# EAGLE schematic seven_seg (EAGLE 9.6.2)
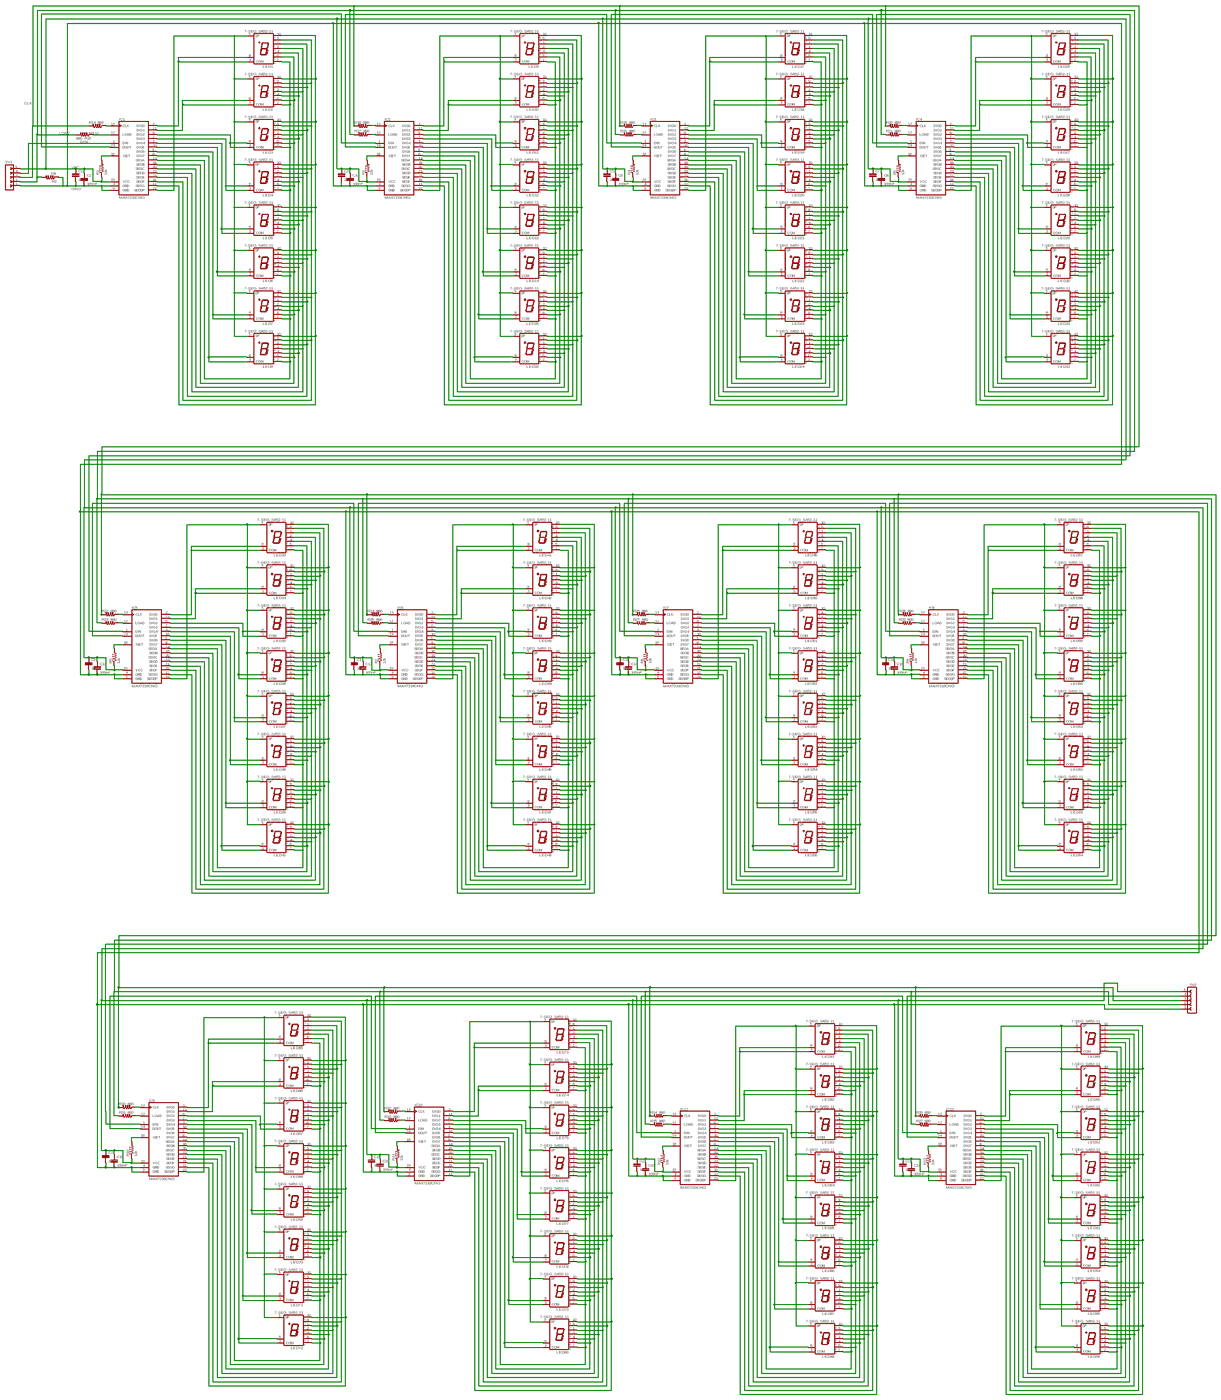
[diagram p0: schematic, sheet 1, overview]
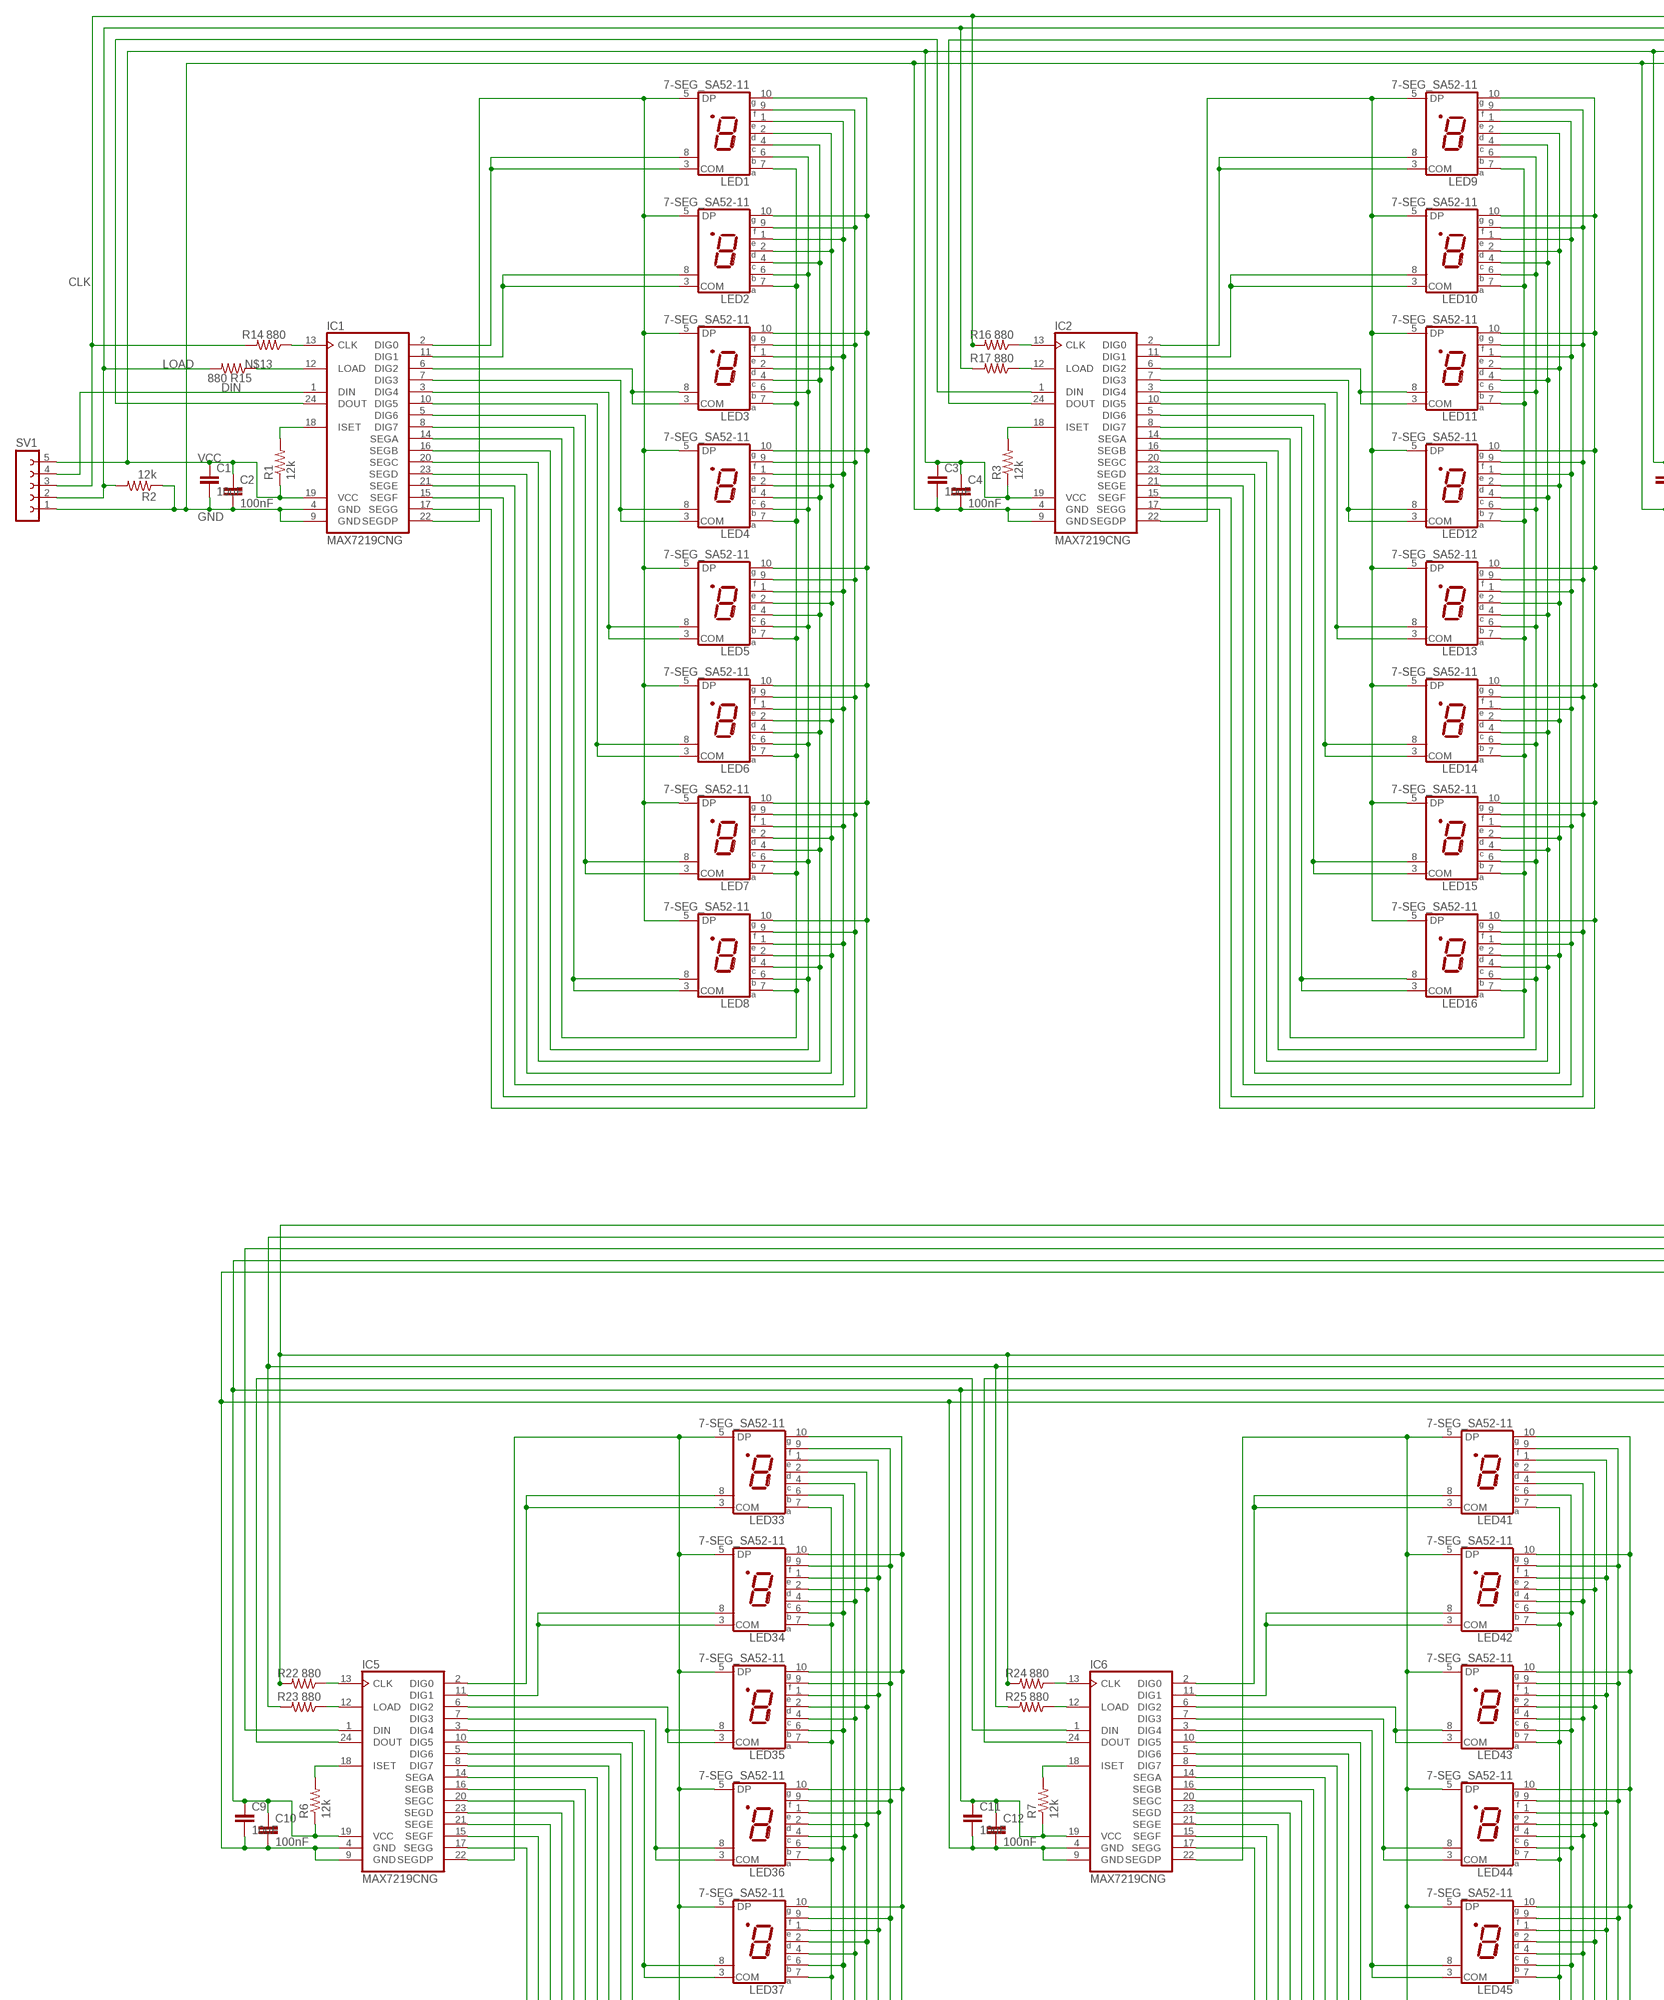
[diagram p1: schematic, sheet 1, part 1 of 4]
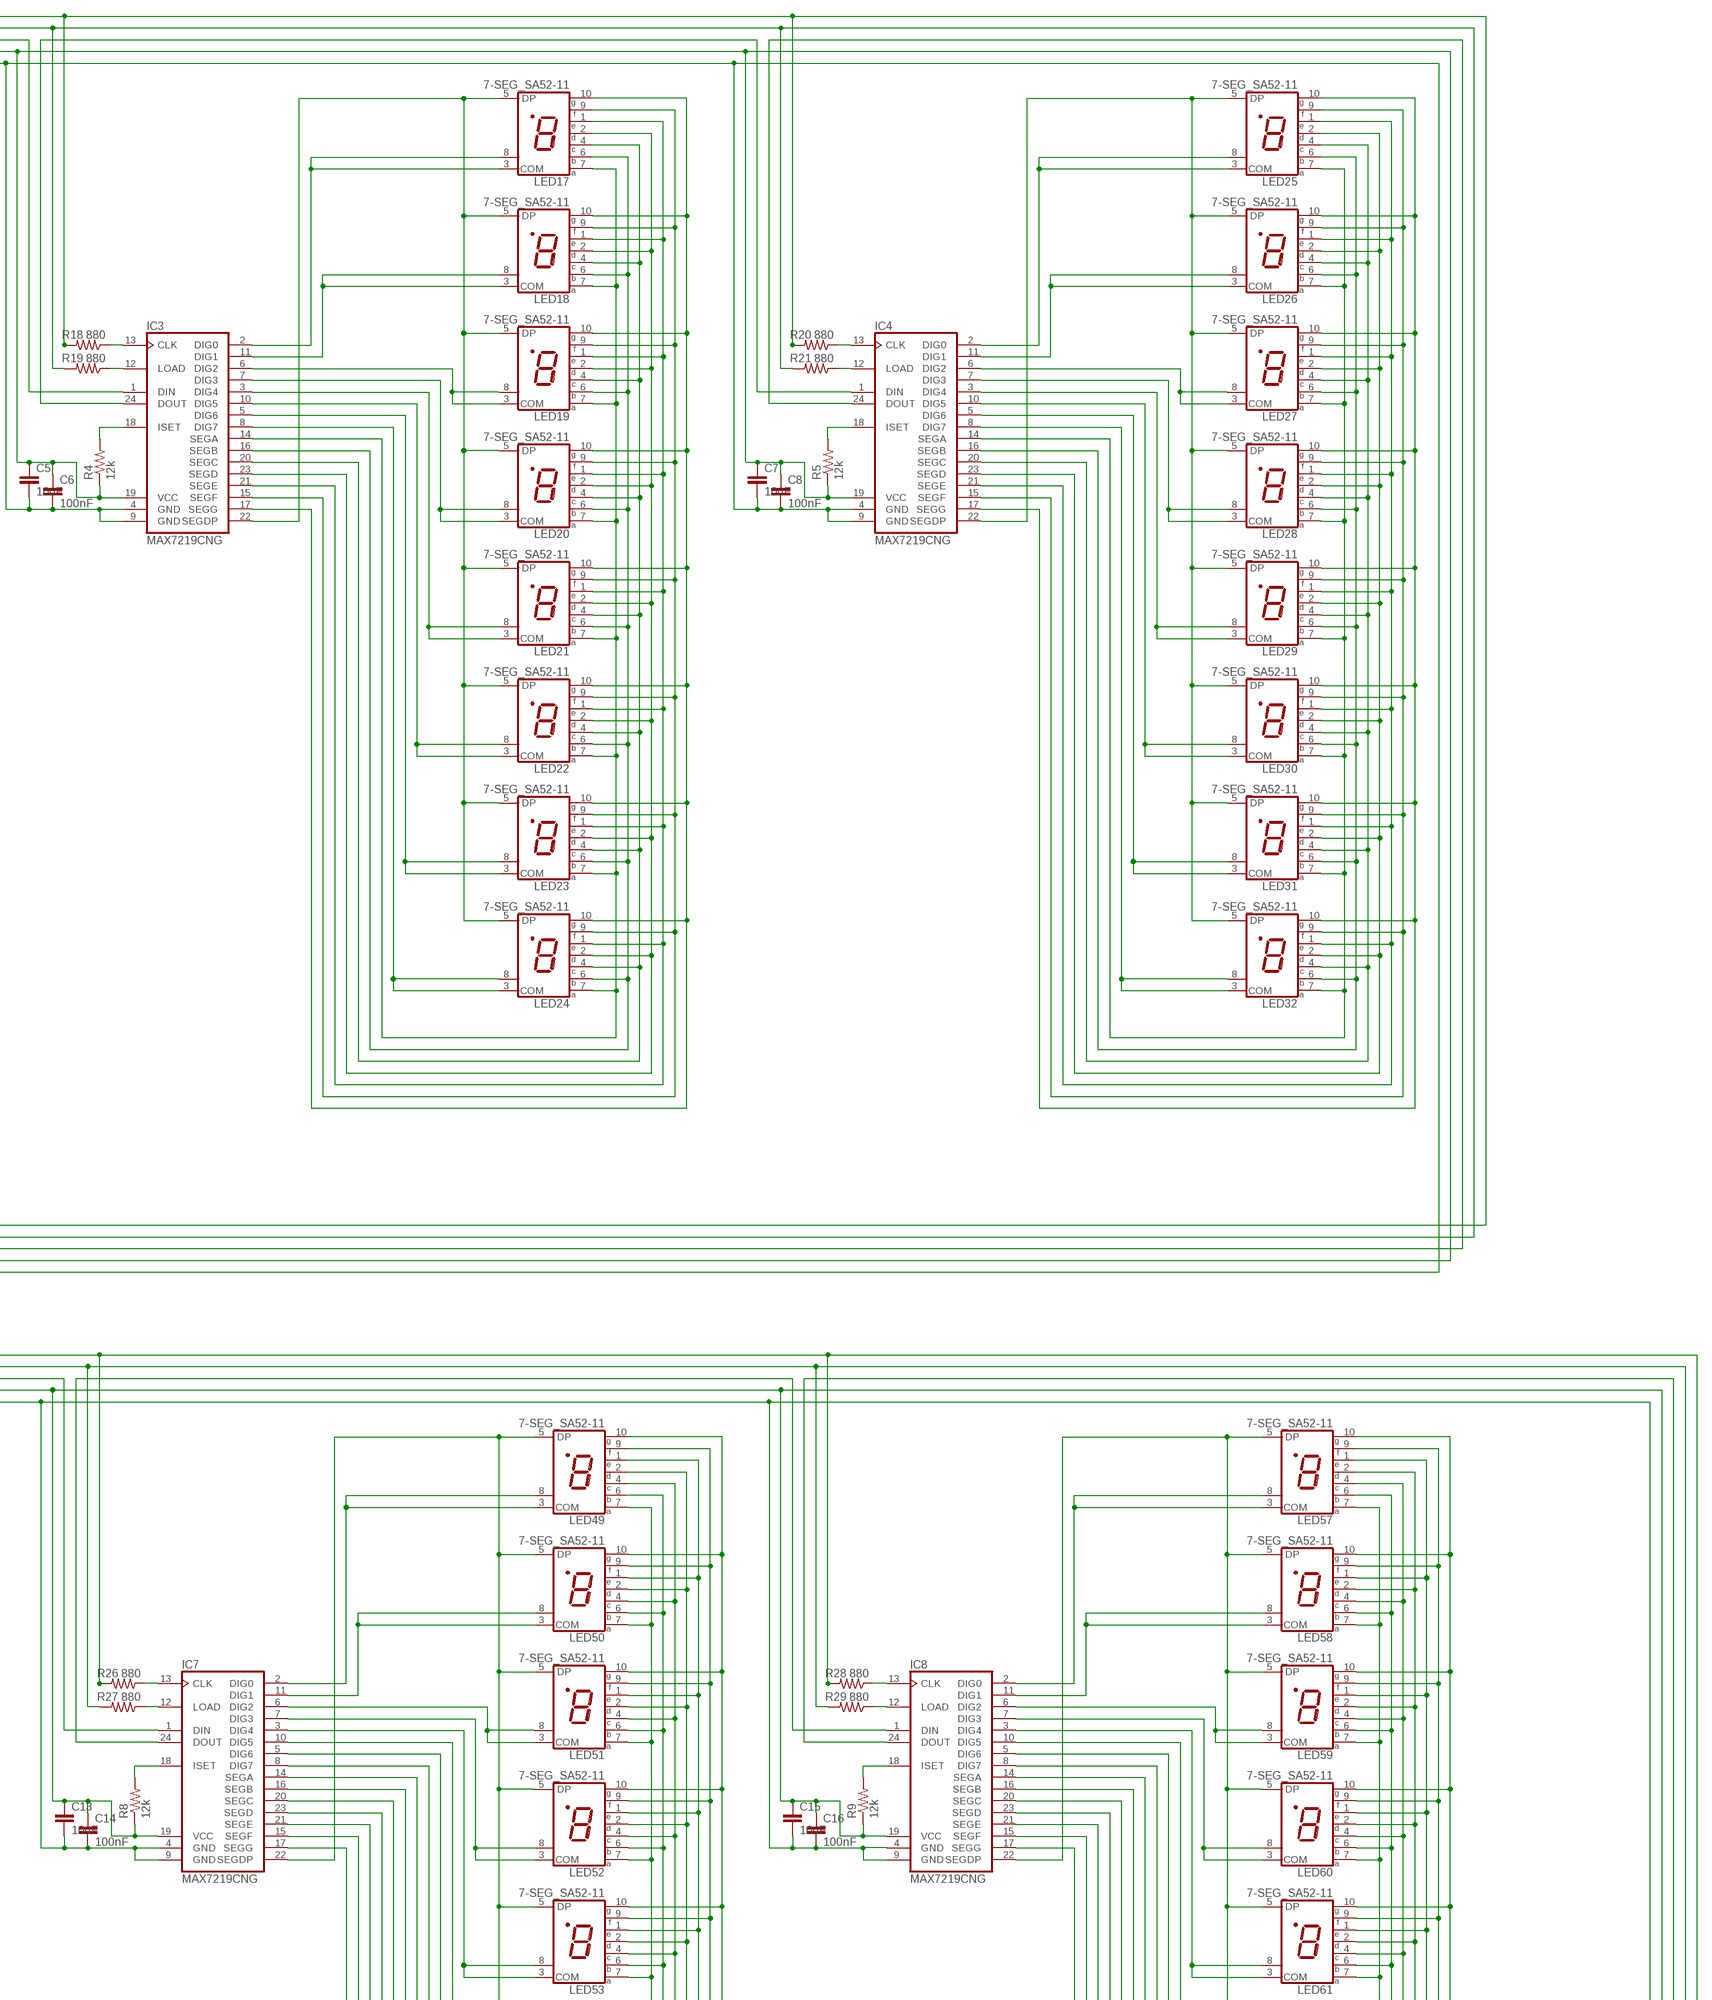
[diagram p2: schematic, sheet 1, part 2 of 4]
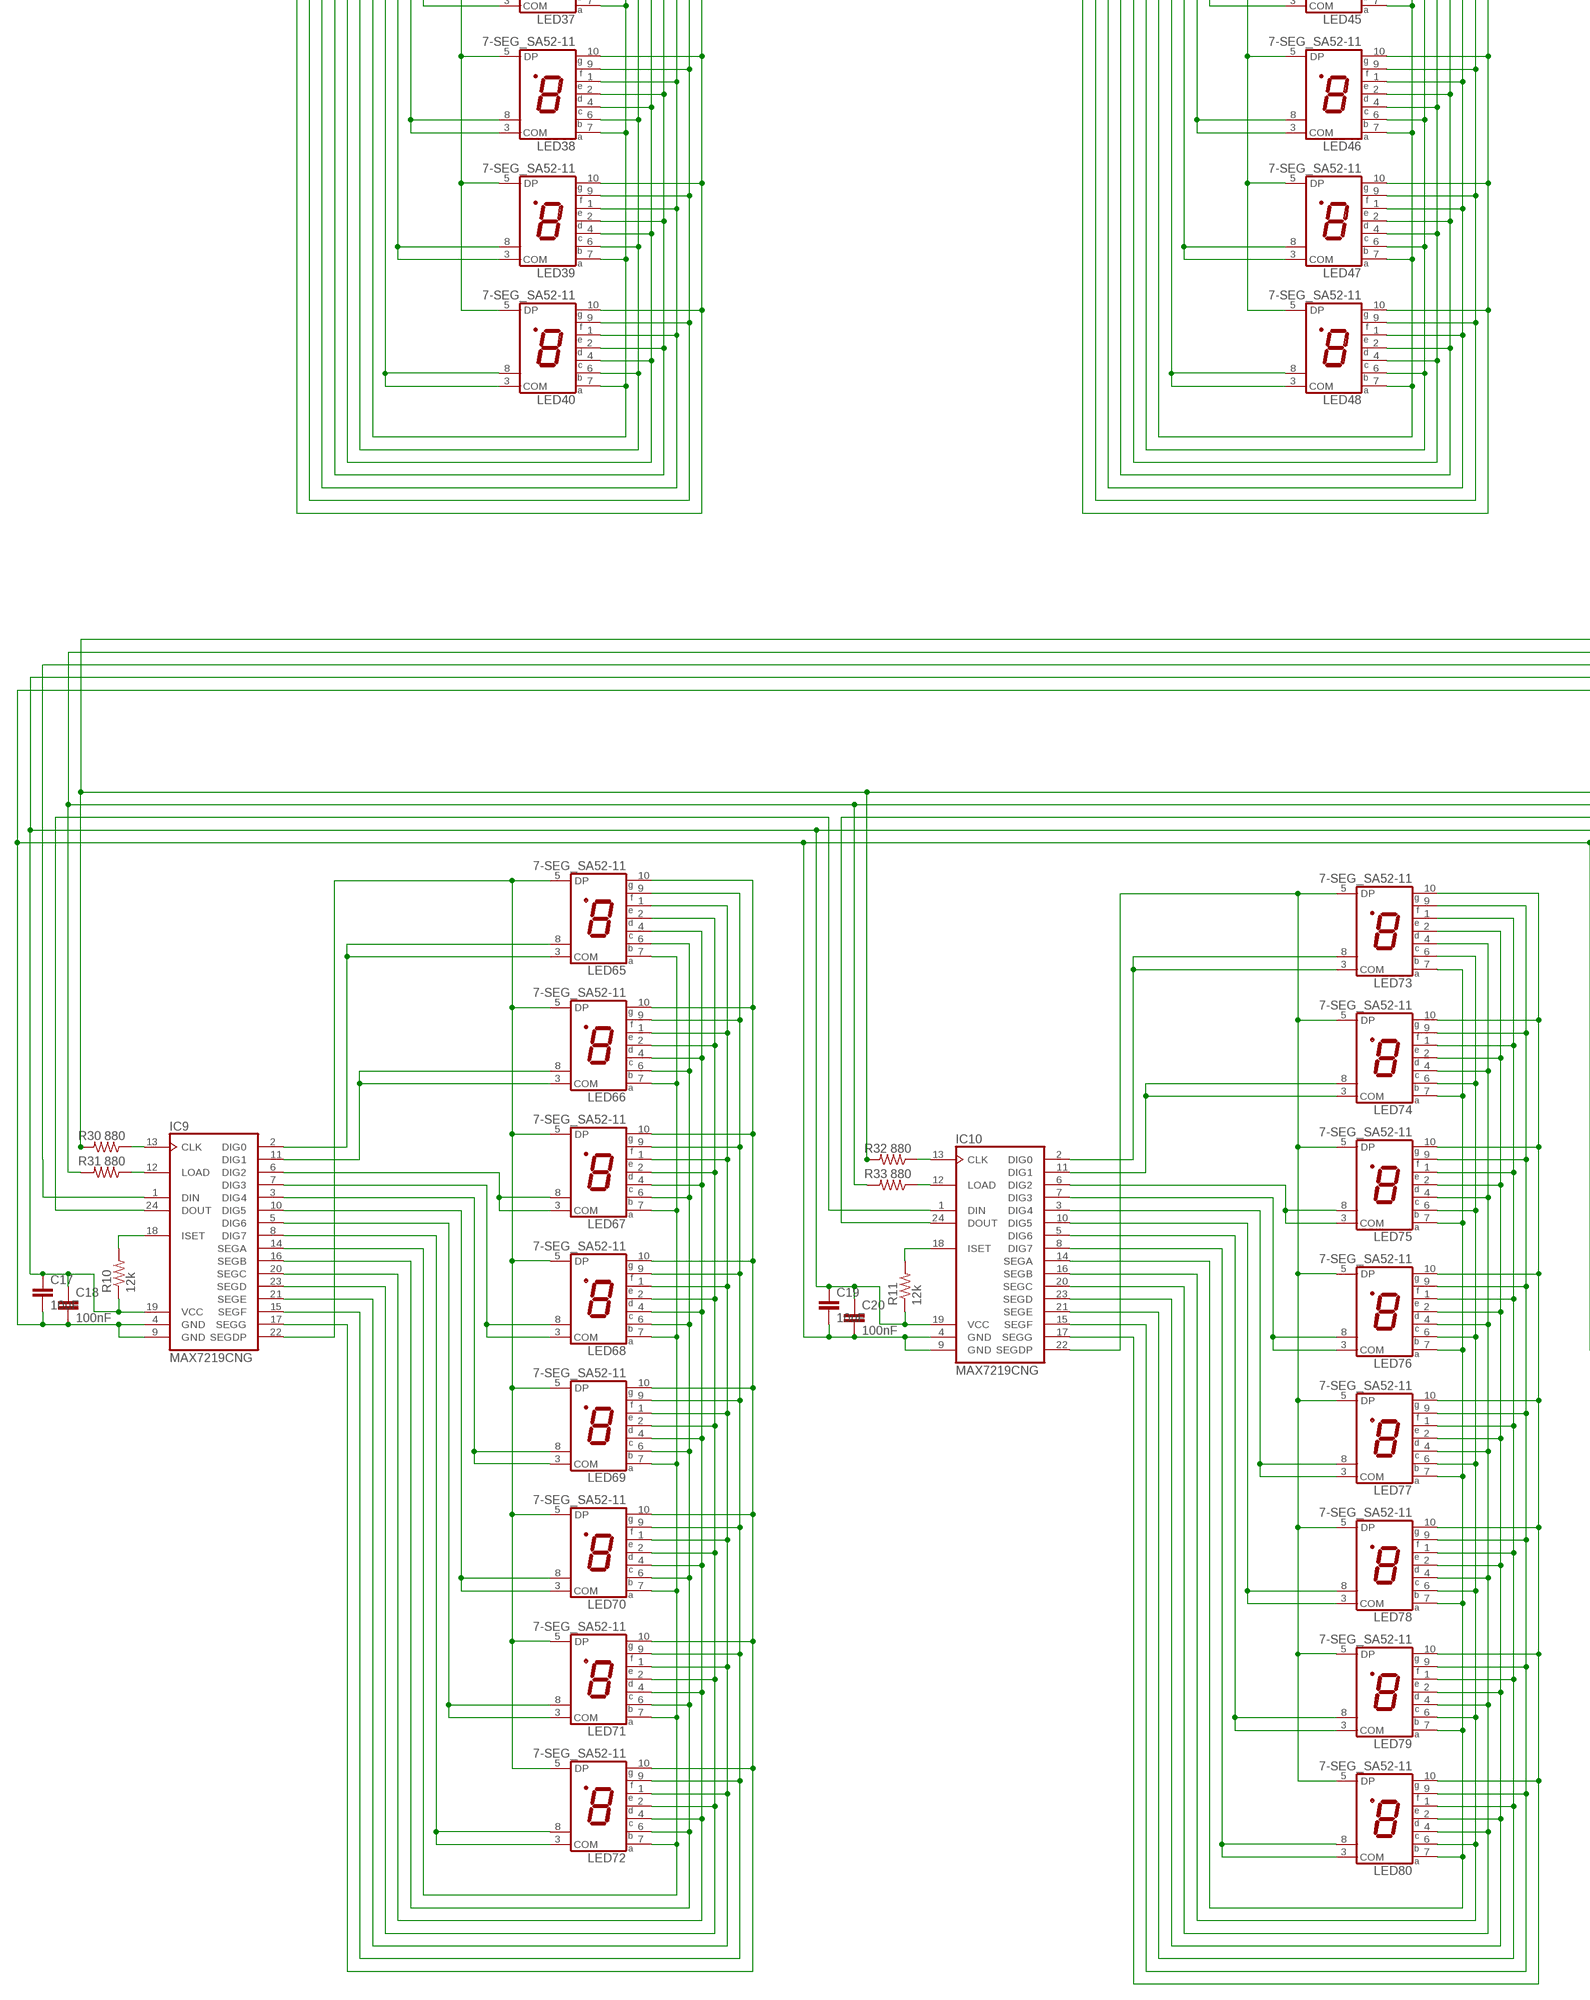
[diagram p3: schematic, sheet 1, part 3 of 4]
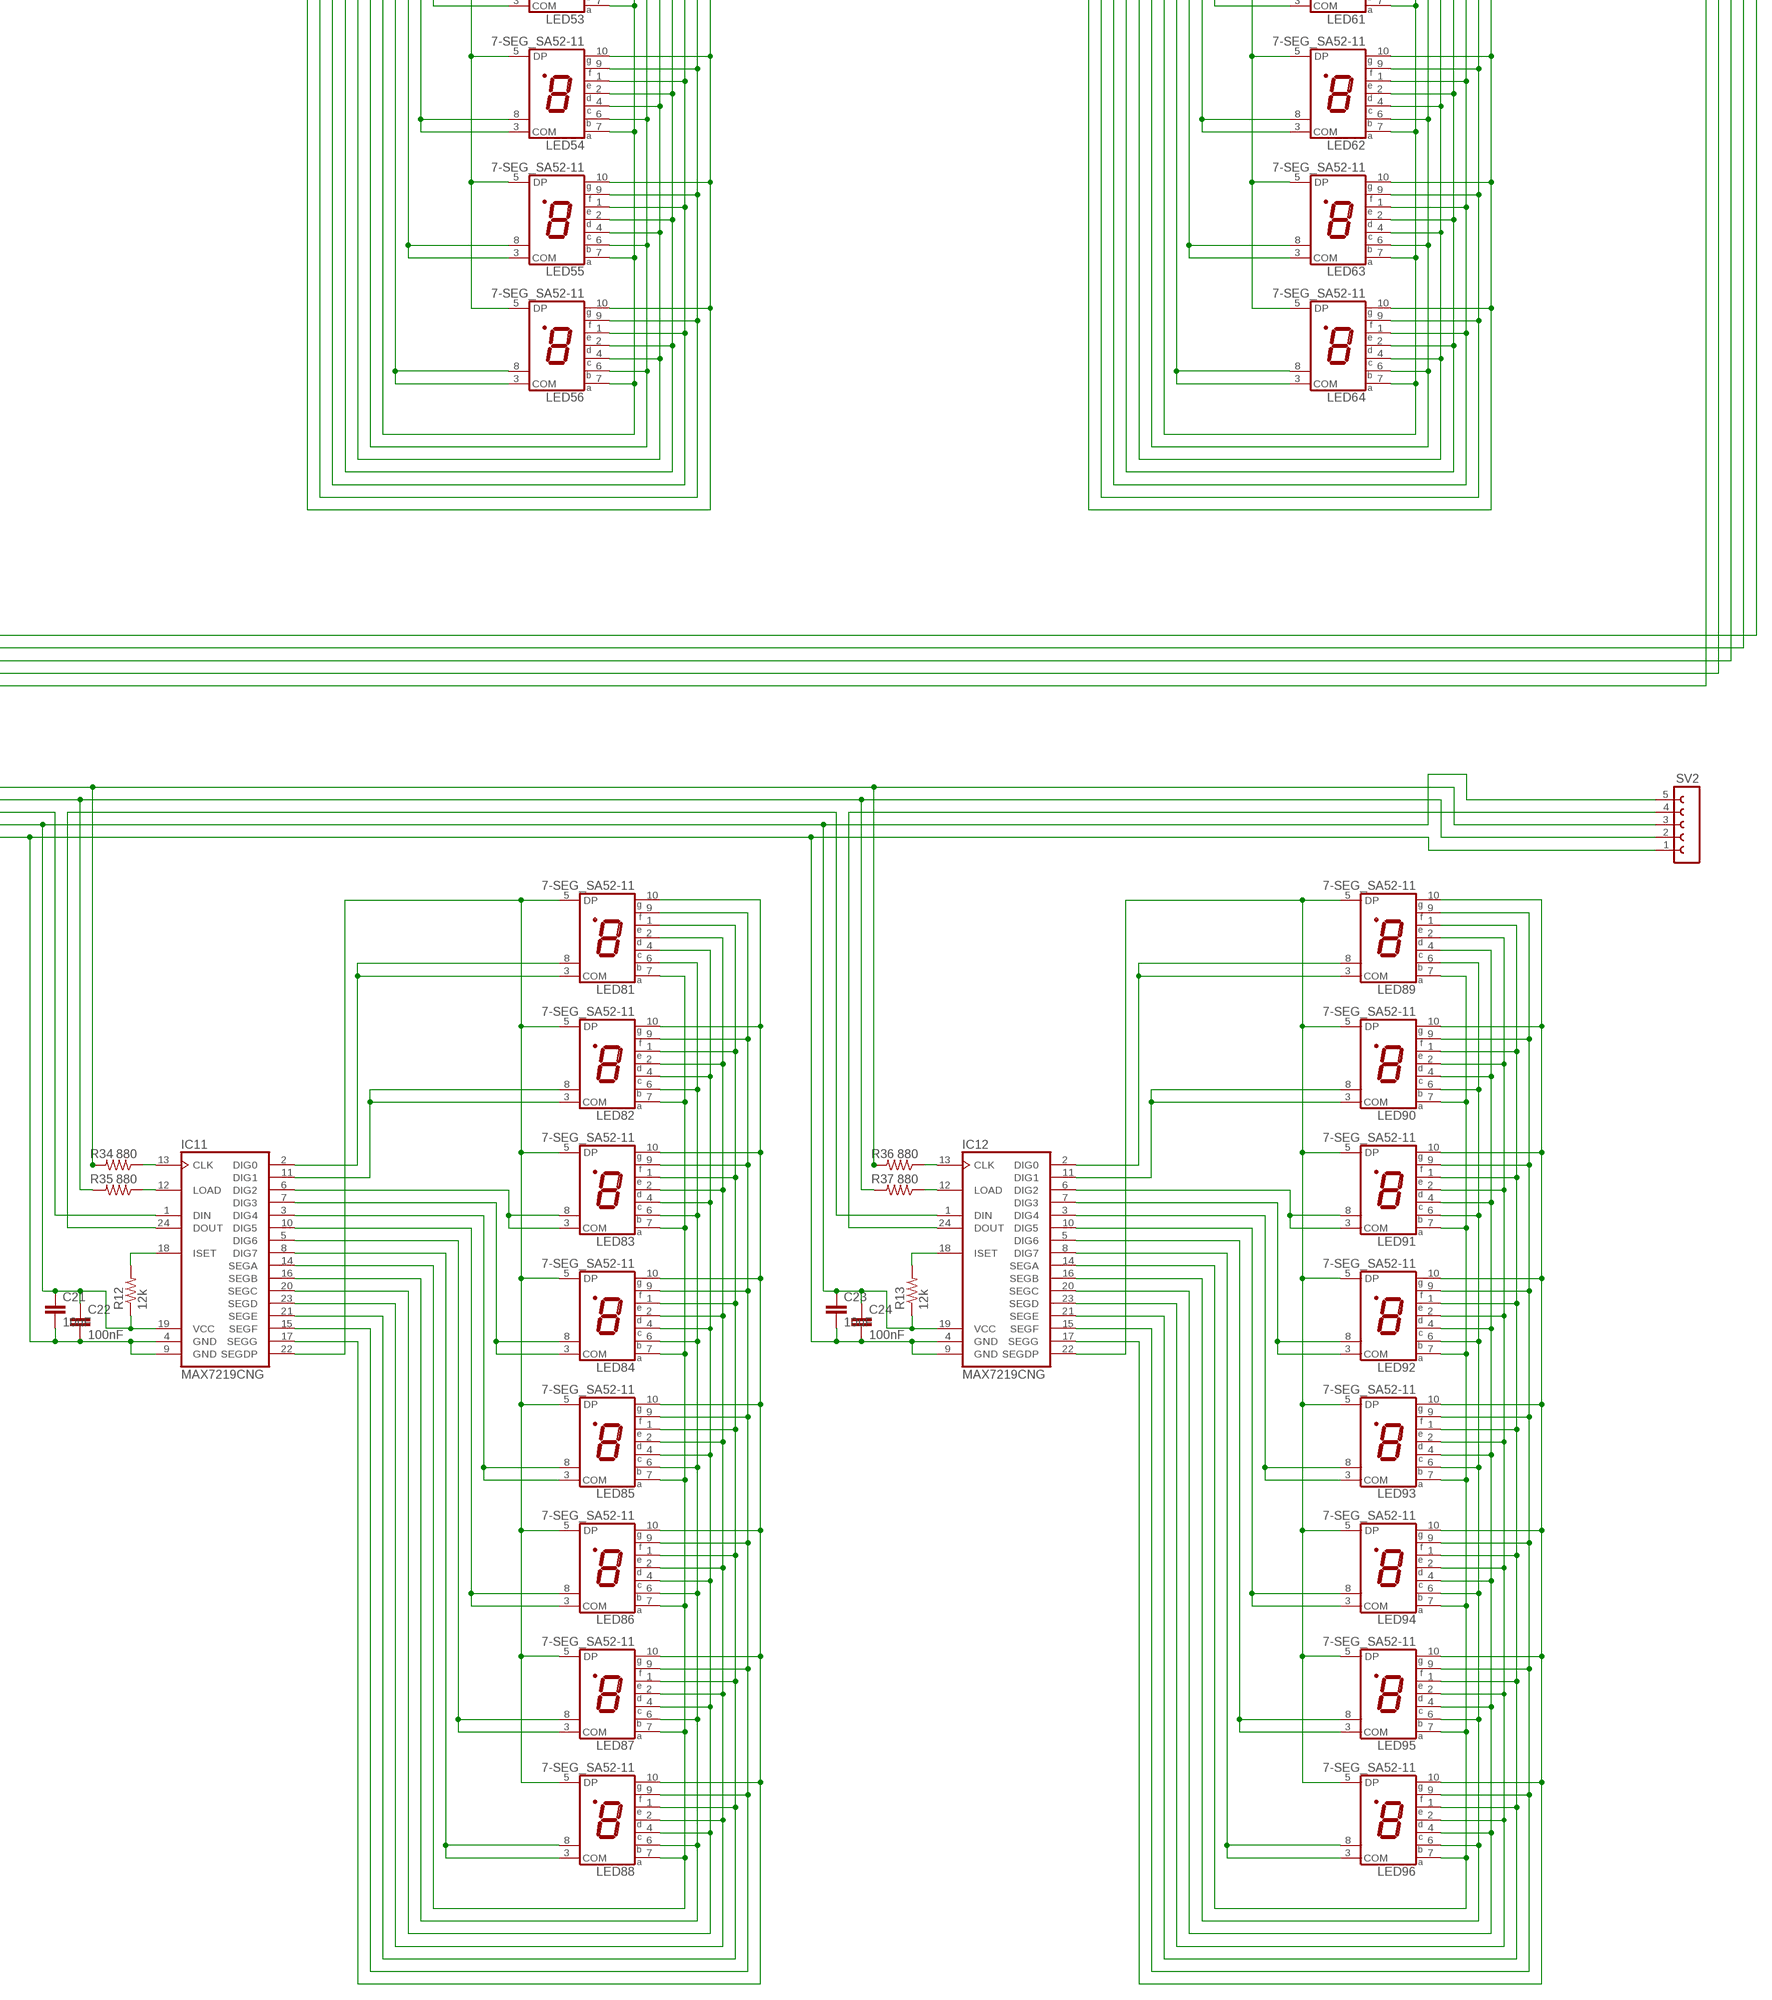
[diagram p4: schematic, sheet 1, part 4 of 4]

## Parts
C1  10uF  C2.5/2  [C2.5-2]
C2  100nF  C2.5/2  [C2.5-2]
C3  10uF  C2.5/2  [C2.5-2]
C4  100nF  C2.5/2  [C2.5-2]
C5  10uF  C2.5/2  [C2.5-2]
C6  100nF  C2.5/2  [C2.5-2]
C7  10uF  C2.5/2  [C2.5-2]
C8  100nF  C2.5/2  [C2.5-2]
C9  10uF  C2.5/2  [C2.5-2]
C10  100nF  C2.5/2  [C2.5-2]
C11  10uF  C2.5/2  [C2.5-2]
C12  100nF  C2.5/2  [C2.5-2]
C13  10uF  C2.5/2  [C2.5-2]
C14  100nF  C2.5/2  [C2.5-2]
C15  10uF  C2.5/2  [C2.5-2]
C16  100nF  C2.5/2  [C2.5-2]
C17  10uF  C2.5/2  [C2.5-2]
C18  100nF  C2.5/2  [C2.5-2]
C19  10uF  C2.5/2  [C2.5-2]
C20  100nF  C2.5/2  [C2.5-2]
C21  10uF  C2.5/2  [C2.5-2]
C22  100nF  C2.5/2  [C2.5-2]
C23  10uF  C2.5/2  [C2.5-2]
C24  100nF  C2.5/2  [C2.5-2]
IC1  MAX7219CNG  [DIL24-3]
IC2  MAX7219CNG  [DIL24-3]
IC3  MAX7219CNG  [DIL24-3]
IC4  MAX7219CNG  [DIL24-3]
IC5  MAX7219CNG  [DIL24-3]
IC6  MAX7219CNG  [DIL24-3]
IC7  MAX7219CNG  [DIL24-3]
IC8  MAX7219CNG  [DIL24-3]
IC9  MAX7219CNG  [DIL24-3]
IC10  MAX7219CNG  [DIL24-3]
IC11  MAX7219CNG  [DIL24-3]
IC12  MAX7219CNG  [DIL24-3]
LED1  7-SEG_SA52-11  [SA52-11]
LED2  7-SEG_SA52-11  [SA52-11]
LED3  7-SEG_SA52-11  [SA52-11]
LED4  7-SEG_SA52-11  [SA52-11]
LED5  7-SEG_SA52-11  [SA52-11]
LED6  7-SEG_SA52-11  [SA52-11]
LED7  7-SEG_SA52-11  [SA52-11]
LED8  7-SEG_SA52-11  [SA52-11]
LED9  7-SEG_SA52-11  [SA52-11]
LED10  7-SEG_SA52-11  [SA52-11]
LED11  7-SEG_SA52-11  [SA52-11]
LED12  7-SEG_SA52-11  [SA52-11]
LED13  7-SEG_SA52-11  [SA52-11]
LED14  7-SEG_SA52-11  [SA52-11]
LED15  7-SEG_SA52-11  [SA52-11]
LED16  7-SEG_SA52-11  [SA52-11]
LED17  7-SEG_SA52-11  [SA52-11]
LED18  7-SEG_SA52-11  [SA52-11]
LED19  7-SEG_SA52-11  [SA52-11]
LED20  7-SEG_SA52-11  [SA52-11]
LED21  7-SEG_SA52-11  [SA52-11]
LED22  7-SEG_SA52-11  [SA52-11]
LED23  7-SEG_SA52-11  [SA52-11]
LED24  7-SEG_SA52-11  [SA52-11]
LED25  7-SEG_SA52-11  [SA52-11]
LED26  7-SEG_SA52-11  [SA52-11]
LED27  7-SEG_SA52-11  [SA52-11]
LED28  7-SEG_SA52-11  [SA52-11]
LED29  7-SEG_SA52-11  [SA52-11]
LED30  7-SEG_SA52-11  [SA52-11]
LED31  7-SEG_SA52-11  [SA52-11]
LED32  7-SEG_SA52-11  [SA52-11]
LED33  7-SEG_SA52-11  [SA52-11]
LED34  7-SEG_SA52-11  [SA52-11]
LED35  7-SEG_SA52-11  [SA52-11]
LED36  7-SEG_SA52-11  [SA52-11]
LED37  7-SEG_SA52-11  [SA52-11]
LED38  7-SEG_SA52-11  [SA52-11]
LED39  7-SEG_SA52-11  [SA52-11]
LED40  7-SEG_SA52-11  [SA52-11]
LED41  7-SEG_SA52-11  [SA52-11]
LED42  7-SEG_SA52-11  [SA52-11]
LED43  7-SEG_SA52-11  [SA52-11]
LED44  7-SEG_SA52-11  [SA52-11]
LED45  7-SEG_SA52-11  [SA52-11]
LED46  7-SEG_SA52-11  [SA52-11]
LED47  7-SEG_SA52-11  [SA52-11]
LED48  7-SEG_SA52-11  [SA52-11]
LED49  7-SEG_SA52-11  [SA52-11]
LED50  7-SEG_SA52-11  [SA52-11]
LED51  7-SEG_SA52-11  [SA52-11]
LED52  7-SEG_SA52-11  [SA52-11]
LED53  7-SEG_SA52-11  [SA52-11]
LED54  7-SEG_SA52-11  [SA52-11]
LED55  7-SEG_SA52-11  [SA52-11]
LED56  7-SEG_SA52-11  [SA52-11]
LED57  7-SEG_SA52-11  [SA52-11]
LED58  7-SEG_SA52-11  [SA52-11]
LED59  7-SEG_SA52-11  [SA52-11]
LED60  7-SEG_SA52-11  [SA52-11]
LED61  7-SEG_SA52-11  [SA52-11]
LED62  7-SEG_SA52-11  [SA52-11]
LED63  7-SEG_SA52-11  [SA52-11]
LED64  7-SEG_SA52-11  [SA52-11]
LED65  7-SEG_SA52-11  [SA52-11]
LED66  7-SEG_SA52-11  [SA52-11]
LED67  7-SEG_SA52-11  [SA52-11]
LED68  7-SEG_SA52-11  [SA52-11]
LED69  7-SEG_SA52-11  [SA52-11]
LED70  7-SEG_SA52-11  [SA52-11]
LED71  7-SEG_SA52-11  [SA52-11]
LED72  7-SEG_SA52-11  [SA52-11]
LED73  7-SEG_SA52-11  [SA52-11]
LED74  7-SEG_SA52-11  [SA52-11]
LED75  7-SEG_SA52-11  [SA52-11]
LED76  7-SEG_SA52-11  [SA52-11]
LED77  7-SEG_SA52-11  [SA52-11]
LED78  7-SEG_SA52-11  [SA52-11]
LED79  7-SEG_SA52-11  [SA52-11]
LED80  7-SEG_SA52-11  [SA52-11]
LED81  7-SEG_SA52-11  [SA52-11]
LED82  7-SEG_SA52-11  [SA52-11]
LED83  7-SEG_SA52-11  [SA52-11]
LED84  7-SEG_SA52-11  [SA52-11]
LED85  7-SEG_SA52-11  [SA52-11]
LED86  7-SEG_SA52-11  [SA52-11]
LED87  7-SEG_SA52-11  [SA52-11]
LED88  7-SEG_SA52-11  [SA52-11]
LED89  7-SEG_SA52-11  [SA52-11]
LED90  7-SEG_SA52-11  [SA52-11]
LED91  7-SEG_SA52-11  [SA52-11]
LED92  7-SEG_SA52-11  [SA52-11]
LED93  7-SEG_SA52-11  [SA52-11]
LED94  7-SEG_SA52-11  [SA52-11]
LED95  7-SEG_SA52-11  [SA52-11]
LED96  7-SEG_SA52-11  [SA52-11]
R1  12k  R-US_0204/7  [0204/7]
R2  12k  R-US_0204/7  [0204/7]
R3  12k  R-US_0204/7  [0204/7]
R4  12k  R-US_0204/7  [0204/7]
R5  12k  R-US_0204/7  [0204/7]
R6  12k  R-US_0204/7  [0204/7]
R7  12k  R-US_0204/7  [0204/7]
R8  12k  R-US_0204/7  [0204/7]
R9  12k  R-US_0204/7  [0204/7]
R10  12k  R-US_0204/7  [0204/7]
R11  12k  R-US_0204/7  [0204/7]
R12  12k  R-US_0204/7  [0204/7]
R13  12k  R-US_0204/7  [0204/7]
R14  880  R-US_0204/7  [0204/7]
R15  880  R-US_0204/7  [0204/7]
R16  880  R-US_0204/7  [0204/7]
R17  880  R-US_0204/7  [0204/7]
R18  880  R-US_0204/7  [0204/7]
R19  880  R-US_0204/7  [0204/7]
R20  880  R-US_0204/7  [0204/7]
R21  880  R-US_0204/7  [0204/7]
R22  880  R-US_0204/7  [0204/7]
R23  880  R-US_0204/7  [0204/7]
R24  880  R-US_0204/7  [0204/7]
R25  880  R-US_0204/7  [0204/7]
R26  880  R-US_0204/7  [0204/7]
R27  880  R-US_0204/7  [0204/7]
R28  880  R-US_0204/7  [0204/7]
R29  880  R-US_0204/7  [0204/7]
R30  880  R-US_0204/7  [0204/7]
R31  880  R-US_0204/7  [0204/7]
R32  880  R-US_0204/7  [0204/7]
R33  880  R-US_0204/7  [0204/7]
R34  880  R-US_0204/7  [0204/7]
R35  880  R-US_0204/7  [0204/7]
R36  880  R-US_0204/7  [0204/7]
R37  880  R-US_0204/7  [0204/7]
SV1  FE05-1  [FE05-1]
SV2  FE05-1  [FE05-1]

## Nets
CLK: R14.2 R16.2 R18.2 R20.2 R22.2 R24.2 R26.2 R28.2 R30.2 R32.2 R34.2 R36.2 SV1.3 SV2.3
DIN: IC1.1(DIN) SV1.4
GND: C1.2 C2.2 C3.2 C4.2 C5.2 C6.2 C7.2 C8.2 C9.2 C10.2 C11.2 C12.2 C13.2 C14.2 C15.2 C16.2 C17.2 C18.2 C19.2 C20.2 C21.2 C22.2 C23.2 C24.2 IC1.4(GND) IC1.9(GND) IC2.4(GND) IC2.9(GND) IC3.4(GND) IC3.9(GND) IC4.4(GND) IC4.9(GND) IC5.4(GND) IC5.9(GND) IC6.4(GND) IC6.9(GND) IC7.4(GND) IC7.9(GND) IC8.4(GND) IC8.9(GND) IC9.4(GND) IC9.9(GND) IC10.4(GND) IC10.9(GND) IC11.4(GND) IC11.9(GND) IC12.4(GND) IC12.9(GND) R2.1 SV1.1 SV2.1
LOAD: R2.2 R15.2 R17.2 R19.2 R21.2 R23.2 R25.2 R27.2 R29.2 R31.2 R33.2 R35.2 R37.2 SV1.2 SV2.2
N$1: IC1.2(DIG0) LED1.3(COM) LED1.8(COM)
N$2: IC1.11(DIG1) LED2.3(COM) LED2.8(COM)
N$3: IC1.6(DIG2) LED3.3(COM) LED3.8(COM)
N$4: IC1.7(DIG3) LED4.3(COM) LED4.8(COM)
N$5: IC1.3(DIG4) LED5.3(COM) LED5.8(COM)
N$6: IC1.10(DIG5) LED6.3(COM) LED6.8(COM)
N$7: IC1.5(DIG6) LED7.3(COM) LED7.8(COM)
N$8: IC1.8(DIG7) LED8.3(COM) LED8.8(COM)
N$9: IC1.15(SEGF) LED1.9(F) LED2.9(F) LED3.9(F) LED4.9(F) LED5.9(F) LED6.9(F) LED7.9(F) LED8.9(F)
N$10: IC2.18(ISET) R3.2
N$11: IC2.22(SEGDP) LED9.5(DP) LED10.5(DP) LED11.5(DP) LED12.5(DP) LED13.5(DP) LED14.5(DP) LED15.5(DP) LED16.5(DP)
N$12: IC1.13(CLK) R14.1
N$13: IC1.12(LOAD) R15.1
N$14: IC2.13(CLK) R16.1
N$15: IC2.2(DIG0) LED9.3(COM) LED9.8(COM)
N$16: IC1.18(ISET) R1.2
N$17: IC1.14(SEGA) LED1.7(A) LED2.7(A) LED3.7(A) LED4.7(A) LED5.7(A) LED6.7(A) LED7.7(A) LED8.7(A)
N$18: IC1.22(SEGDP) LED1.5(DP) LED2.5(DP) LED3.5(DP) LED4.5(DP) LED5.5(DP) LED6.5(DP) LED7.5(DP) LED8.5(DP)
N$19: IC1.16(SEGB) LED1.6(B) LED2.6(B) LED3.6(B) LED4.6(B) LED5.6(B) LED6.6(B) LED7.6(B) LED8.6(B)
N$20: IC1.20(SEGC) LED1.4(C) LED2.4(C) LED3.4(C) LED4.4(C) LED5.4(C) LED6.4(C) LED7.4(C) LED8.4(C)
N$21: IC1.23(SEGD) LED1.2(D) LED2.2(D) LED3.2(D) LED4.2(D) LED5.2(D) LED6.2(D) LED7.2(D) LED8.2(D)
N$22: IC1.21(SEGE) LED1.1(E) LED2.1(E) LED3.1(E) LED4.1(E) LED5.1(E) LED6.1(E) LED7.1(E) LED8.1(E)
N$23: IC2.11(DIG1) LED10.3(COM) LED10.8(COM)
N$24: IC1.17(SEGG) LED1.10(G) LED2.10(G) LED3.10(G) LED4.10(G) LED5.10(G) LED6.10(G) LED7.10(G) LED8.10(G)
N$25: IC2.6(DIG2) LED11.3(COM) LED11.8(COM)
N$26: IC2.7(DIG3) LED12.3(COM) LED12.8(COM)
N$27: IC2.3(DIG4) LED13.3(COM) LED13.8(COM)
N$28: IC2.10(DIG5) LED14.3(COM) LED14.8(COM)
N$29: IC2.5(DIG6) LED15.3(COM) LED15.8(COM)
N$30: IC2.8(DIG7) LED16.3(COM) LED16.8(COM)
N$31: IC2.14(SEGA) LED9.7(A) LED10.7(A) LED11.7(A) LED12.7(A) LED13.7(A) LED14.7(A) LED15.7(A) LED16.7(A)
N$32: IC2.16(SEGB) LED9.6(B) LED10.6(B) LED11.6(B) LED12.6(B) LED13.6(B) LED14.6(B) LED15.6(B) LED16.6(B)
N$33: IC2.20(SEGC) LED9.4(C) LED10.4(C) LED11.4(C) LED12.4(C) LED13.4(C) LED14.4(C) LED15.4(C) LED16.4(C)
N$34: IC2.23(SEGD) LED9.2(D) LED10.2(D) LED11.2(D) LED12.2(D) LED13.2(D) LED14.2(D) LED15.2(D) LED16.2(D)
N$35: IC2.21(SEGE) LED9.1(E) LED10.1(E) LED11.1(E) LED12.1(E) LED13.1(E) LED14.1(E) LED15.1(E) LED16.1(E)
N$36: IC2.17(SEGG) LED9.10(G) LED10.10(G) LED11.10(G) LED12.10(G) LED13.10(G) LED14.10(G) LED15.10(G) LED16.10(G)
N$37: IC2.15(SEGF) LED9.9(F) LED10.9(F) LED11.9(F) LED12.9(F) LED13.9(F) LED14.9(F) LED15.9(F) LED16.9(F)
N$38: IC2.24(DOUT) IC3.1(DIN)
N$39: IC10.3(DIG4) LED77.3(COM) LED77.8(COM)
N$40: IC2.12(LOAD) R17.1
N$41: IC3.13(CLK) R18.1
N$42: IC1.24(DOUT) IC2.1(DIN)
N$43: IC3.12(LOAD) R19.1
N$44: IC4.13(CLK) R20.1
N$45: IC4.12(LOAD) R21.1
N$46: IC3.18(ISET) R4.2
N$47: IC3.22(SEGDP) LED17.5(DP) LED18.5(DP) LED19.5(DP) LED20.5(DP) LED21.5(DP) LED22.5(DP) LED23.5(DP) LED24.5(DP)
N$48: IC3.2(DIG0) LED17.3(COM) LED17.8(COM)
N$49: IC3.11(DIG1) LED18.3(COM) LED18.8(COM)
N$50: IC3.6(DIG2) LED19.3(COM) LED19.8(COM)
N$51: IC3.7(DIG3) LED20.3(COM) LED20.8(COM)
N$52: IC3.3(DIG4) LED21.3(COM) LED21.8(COM)
N$53: IC3.10(DIG5) LED22.3(COM) LED22.8(COM)
N$54: IC3.5(DIG6) LED23.3(COM) LED23.8(COM)
N$55: IC3.8(DIG7) LED24.3(COM) LED24.8(COM)
N$56: IC3.14(SEGA) LED17.7(A) LED18.7(A) LED19.7(A) LED20.7(A) LED21.7(A) LED22.7(A) LED23.7(A) LED24.7(A)
N$57: IC3.16(SEGB) LED17.6(B) LED18.6(B) LED19.6(B) LED20.6(B) LED21.6(B) LED22.6(B) LED23.6(B) LED24.6(B)
N$58: IC3.20(SEGC) LED17.4(C) LED18.4(C) LED19.4(C) LED20.4(C) LED21.4(C) LED22.4(C) LED23.4(C) LED24.4(C)
N$59: IC3.23(SEGD) LED17.2(D) LED18.2(D) LED19.2(D) LED20.2(D) LED21.2(D) LED22.2(D) LED23.2(D) LED24.2(D)
N$60: IC3.21(SEGE) LED17.1(E) LED18.1(E) LED19.1(E) LED20.1(E) LED21.1(E) LED22.1(E) LED23.1(E) LED24.1(E)
N$61: IC3.17(SEGG) LED17.10(G) LED18.10(G) LED19.10(G) LED20.10(G) LED21.10(G) LED22.10(G) LED23.10(G) LED24.10(G)
N$62: IC3.15(SEGF) LED17.9(F) LED18.9(F) LED19.9(F) LED20.9(F) LED21.9(F) LED22.9(F) LED23.9(F) LED24.9(F)
N$63: IC5.13(CLK) R22.1
N$64: IC5.12(LOAD) R23.1
N$65: IC6.13(CLK) R24.1
N$66: IC4.18(ISET) R5.2
N$67: IC3.24(DOUT) IC4.1(DIN)
N$68: IC4.22(SEGDP) LED25.5(DP) LED26.5(DP) LED27.5(DP) LED28.5(DP) LED29.5(DP) LED30.5(DP) LED31.5(DP) LED32.5(DP)
N$69: IC4.2(DIG0) LED25.3(COM) LED25.8(COM)
N$70: IC4.11(DIG1) LED26.3(COM) LED26.8(COM)
N$71: IC4.6(DIG2) LED27.3(COM) LED27.8(COM)
N$72: IC4.7(DIG3) LED28.3(COM) LED28.8(COM)
N$73: IC4.3(DIG4) LED29.3(COM) LED29.8(COM)
N$74: IC4.10(DIG5) LED30.3(COM) LED30.8(COM)
N$75: IC4.5(DIG6) LED31.3(COM) LED31.8(COM)
N$76: IC4.8(DIG7) LED32.3(COM) LED32.8(COM)
N$77: IC4.14(SEGA) LED25.7(A) LED26.7(A) LED27.7(A) LED28.7(A) LED29.7(A) LED30.7(A) LED31.7(A) LED32.7(A)
N$78: IC4.16(SEGB) LED25.6(B) LED26.6(B) LED27.6(B) LED28.6(B) LED29.6(B) LED30.6(B) LED31.6(B) LED32.6(B)
N$79: IC4.20(SEGC) LED25.4(C) LED26.4(C) LED27.4(C) LED28.4(C) LED29.4(C) LED30.4(C) LED31.4(C) LED32.4(C)
N$80: IC4.23(SEGD) LED25.2(D) LED26.2(D) LED27.2(D) LED28.2(D) LED29.2(D) LED30.2(D) LED31.2(D) LED32.2(D)
N$81: IC4.21(SEGE) LED25.1(E) LED26.1(E) LED27.1(E) LED28.1(E) LED29.1(E) LED30.1(E) LED31.1(E) LED32.1(E)
N$82: IC4.17(SEGG) LED25.10(G) LED26.10(G) LED27.10(G) LED28.10(G) LED29.10(G) LED30.10(G) LED31.10(G) LED32.10(G)
N$83: IC4.15(SEGF) LED25.9(F) LED26.9(F) LED27.9(F) LED28.9(F) LED29.9(F) LED30.9(F) LED31.9(F) LED32.9(F)
N$84: IC6.12(LOAD) R25.1
N$85: IC4.24(DOUT) IC5.1(DIN)
N$86: IC7.13(CLK) R26.1
N$87: IC7.12(LOAD) R27.1
N$88: IC8.13(CLK) R28.1
N$89: IC8.12(LOAD) R29.1
N$90: IC9.13(CLK) R30.1
N$91: IC5.18(ISET) R6.2
N$92: IC5.22(SEGDP) LED33.5(DP) LED34.5(DP) LED35.5(DP) LED36.5(DP) LED37.5(DP) LED38.5(DP) LED39.5(DP) LED40.5(DP)
N$93: IC5.2(DIG0) LED33.3(COM) LED33.8(COM)
N$94: IC5.11(DIG1) LED34.3(COM) LED34.8(COM)
N$95: IC5.6(DIG2) LED35.3(COM) LED35.8(COM)
N$96: IC5.7(DIG3) LED36.3(COM) LED36.8(COM)
N$97: IC5.3(DIG4) LED37.3(COM) LED37.8(COM)
N$98: IC5.10(DIG5) LED38.3(COM) LED38.8(COM)
N$99: IC5.5(DIG6) LED39.3(COM) LED39.8(COM)
N$100: IC5.8(DIG7) LED40.3(COM) LED40.8(COM)
N$101: IC5.14(SEGA) LED33.7(A) LED34.7(A) LED35.7(A) LED36.7(A) LED37.7(A) LED38.7(A) LED39.7(A) LED40.7(A)
N$102: IC5.16(SEGB) LED33.6(B) LED34.6(B) LED35.6(B) LED36.6(B) LED37.6(B) LED38.6(B) LED39.6(B) LED40.6(B)
N$103: IC5.20(SEGC) LED33.4(C) LED34.4(C) LED35.4(C) LED36.4(C) LED37.4(C) LED38.4(C) LED39.4(C) LED40.4(C)
N$104: IC5.23(SEGD) LED33.2(D) LED34.2(D) LED35.2(D) LED36.2(D) LED37.2(D) LED38.2(D) LED39.2(D) LED40.2(D)
N$105: IC5.21(SEGE) LED33.1(E) LED34.1(E) LED35.1(E) LED36.1(E) LED37.1(E) LED38.1(E) LED39.1(E) LED40.1(E)
N$106: IC5.17(SEGG) LED33.10(G) LED34.10(G) LED35.10(G) LED36.10(G) LED37.10(G) LED38.10(G) LED39.10(G) LED40.10(G)
N$107: IC5.15(SEGF) LED33.9(F) LED34.9(F) LED35.9(F) LED36.9(F) LED37.9(F) LED38.9(F) LED39.9(F) LED40.9(F)
N$108: IC9.12(LOAD) R31.1
N$109: IC5.24(DOUT) IC6.1(DIN)
N$110: IC10.13(CLK) R32.1
N$111: IC10.12(LOAD) R33.1
N$112: IC11.13(CLK) R34.1
N$113: IC11.12(LOAD) R35.1
N$114: IC12.13(CLK) R36.1
N$115: IC6.18(ISET) R7.2
N$116: IC6.22(SEGDP) LED41.5(DP) LED42.5(DP) LED43.5(DP) LED44.5(DP) LED45.5(DP) LED46.5(DP) LED47.5(DP) LED48.5(DP)
N$117: IC6.2(DIG0) LED41.3(COM) LED41.8(COM)
N$118: IC6.11(DIG1) LED42.3(COM) LED42.8(COM)
N$119: IC6.6(DIG2) LED43.3(COM) LED43.8(COM)
N$120: IC6.7(DIG3) LED44.3(COM) LED44.8(COM)
N$121: IC6.3(DIG4) LED45.3(COM) LED45.8(COM)
N$122: IC6.10(DIG5) LED46.3(COM) LED46.8(COM)
N$123: IC6.5(DIG6) LED47.3(COM) LED47.8(COM)
N$124: IC6.8(DIG7) LED48.3(COM) LED48.8(COM)
N$125: IC6.14(SEGA) LED41.7(A) LED42.7(A) LED43.7(A) LED44.7(A) LED45.7(A) LED46.7(A) LED47.7(A) LED48.7(A)
N$126: IC6.16(SEGB) LED41.6(B) LED42.6(B) LED43.6(B) LED44.6(B) LED45.6(B) LED46.6(B) LED47.6(B) LED48.6(B)
N$127: IC6.20(SEGC) LED41.4(C) LED42.4(C) LED43.4(C) LED44.4(C) LED45.4(C) LED46.4(C) LED47.4(C) LED48.4(C)
N$128: IC6.23(SEGD) LED41.2(D) LED42.2(D) LED43.2(D) LED44.2(D) LED45.2(D) LED46.2(D) LED47.2(D) LED48.2(D)
N$129: IC6.21(SEGE) LED41.1(E) LED42.1(E) LED43.1(E) LED44.1(E) LED45.1(E) LED46.1(E) LED47.1(E) LED48.1(E)
N$130: IC6.17(SEGG) LED41.10(G) LED42.10(G) LED43.10(G) LED44.10(G) LED45.10(G) LED46.10(G) LED47.10(G) LED48.10(G)
N$131: IC6.15(SEGF) LED41.9(F) LED42.9(F) LED43.9(F) LED44.9(F) LED45.9(F) LED46.9(F) LED47.9(F) LED48.9(F)
N$132: IC12.12(LOAD) R37.1
N$133: IC6.24(DOUT) IC7.1(DIN)
N$139: IC7.18(ISET) R8.2
N$140: IC7.22(SEGDP) LED49.5(DP) LED50.5(DP) LED51.5(DP) LED52.5(DP) LED53.5(DP) LED54.5(DP) LED55.5(DP) LED56.5(DP)
N$141: IC7.2(DIG0) LED49.3(COM) LED49.8(COM)
N$142: IC7.11(DIG1) LED50.3(COM) LED50.8(COM)
N$143: IC7.6(DIG2) LED51.3(COM) LED51.8(COM)
N$144: IC7.7(DIG3) LED52.3(COM) LED52.8(COM)
N$145: IC7.3(DIG4) LED53.3(COM) LED53.8(COM)
N$146: IC7.10(DIG5) LED54.3(COM) LED54.8(COM)
N$147: IC7.5(DIG6) LED55.3(COM) LED55.8(COM)
N$148: IC7.8(DIG7) LED56.3(COM) LED56.8(COM)
N$149: IC7.14(SEGA) LED49.7(A) LED50.7(A) LED51.7(A) LED52.7(A) LED53.7(A) LED54.7(A) LED55.7(A) LED56.7(A)
N$150: IC7.16(SEGB) LED49.6(B) LED50.6(B) LED51.6(B) LED52.6(B) LED53.6(B) LED54.6(B) LED55.6(B) LED56.6(B)
N$151: IC7.20(SEGC) LED49.4(C) LED50.4(C) LED51.4(C) LED52.4(C) LED53.4(C) LED54.4(C) LED55.4(C) LED56.4(C)
N$152: IC7.23(SEGD) LED49.2(D) LED50.2(D) LED51.2(D) LED52.2(D) LED53.2(D) LED54.2(D) LED55.2(D) LED56.2(D)
N$153: IC7.21(SEGE) LED49.1(E) LED50.1(E) LED51.1(E) LED52.1(E) LED53.1(E) LED54.1(E) LED55.1(E) LED56.1(E)
N$154: IC7.17(SEGG) LED49.10(G) LED50.10(G) LED51.10(G) LED52.10(G) LED53.10(G) LED54.10(G) LED55.10(G) LED56.10(G)
N$155: IC7.15(SEGF) LED49.9(F) LED50.9(F) LED51.9(F) LED52.9(F) LED53.9(F) LED54.9(F) LED55.9(F) LED56.9(F)
N$157: IC7.24(DOUT) IC8.1(DIN)
N$163: IC8.18(ISET) R9.2
N$164: IC8.22(SEGDP) LED57.5(DP) LED58.5(DP) LED59.5(DP) LED60.5(DP) LED61.5(DP) LED62.5(DP) LED63.5(DP) LED64.5(DP)
N$165: IC8.2(DIG0) LED57.3(COM) LED57.8(COM)
N$166: IC8.11(DIG1) LED58.3(COM) LED58.8(COM)
N$167: IC8.6(DIG2) LED59.3(COM) LED59.8(COM)
N$168: IC8.7(DIG3) LED60.3(COM) LED60.8(COM)
N$169: IC8.3(DIG4) LED61.3(COM) LED61.8(COM)
N$170: IC8.10(DIG5) LED62.3(COM) LED62.8(COM)
N$171: IC8.5(DIG6) LED63.3(COM) LED63.8(COM)
N$172: IC8.8(DIG7) LED64.3(COM) LED64.8(COM)
N$173: IC8.14(SEGA) LED57.7(A) LED58.7(A) LED59.7(A) LED60.7(A) LED61.7(A) LED62.7(A) LED63.7(A) LED64.7(A)
N$174: IC8.16(SEGB) LED57.6(B) LED58.6(B) LED59.6(B) LED60.6(B) LED61.6(B) LED62.6(B) LED63.6(B) LED64.6(B)
N$175: IC8.20(SEGC) LED57.4(C) LED58.4(C) LED59.4(C) LED60.4(C) LED61.4(C) LED62.4(C) LED63.4(C) LED64.4(C)
N$176: IC8.23(SEGD) LED57.2(D) LED58.2(D) LED59.2(D) LED60.2(D) LED61.2(D) LED62.2(D) LED63.2(D) LED64.2(D)
N$177: IC8.21(SEGE) LED57.1(E) LED58.1(E) LED59.1(E) LED60.1(E) LED61.1(E) LED62.1(E) LED63.1(E) LED64.1(E)
N$178: IC8.17(SEGG) LED57.10(G) LED58.10(G) LED59.10(G) LED60.10(G) LED61.10(G) LED62.10(G) LED63.10(G) LED64.10(G)
N$179: IC8.15(SEGF) LED57.9(F) LED58.9(F) LED59.9(F) LED60.9(F) LED61.9(F) LED62.9(F) LED63.9(F) LED64.9(F)
N$181: IC8.24(DOUT) IC9.1(DIN)
N$182: IC12.18(ISET) R13.2
N$187: IC9.18(ISET) R10.2
N$188: IC9.22(SEGDP) LED65.5(DP) LED66.5(DP) LED67.5(DP) LED68.5(DP) LED69.5(DP) LED70.5(DP) LED71.5(DP) LED72.5(DP)
N$189: IC9.2(DIG0) LED65.3(COM) LED65.8(COM)
N$190: IC9.11(DIG1) LED66.3(COM) LED66.8(COM)
N$191: IC9.6(DIG2) LED67.3(COM) LED67.8(COM)
N$192: IC9.7(DIG3) LED68.3(COM) LED68.8(COM)
N$193: IC9.3(DIG4) LED69.3(COM) LED69.8(COM)
N$194: IC9.10(DIG5) LED70.3(COM) LED70.8(COM)
N$195: IC9.5(DIG6) LED71.3(COM) LED71.8(COM)
N$196: IC9.8(DIG7) LED72.3(COM) LED72.8(COM)
N$197: IC9.14(SEGA) LED65.7(A) LED66.7(A) LED67.7(A) LED68.7(A) LED69.7(A) LED70.7(A) LED71.7(A) LED72.7(A)
N$198: IC9.16(SEGB) LED65.6(B) LED66.6(B) LED67.6(B) LED68.6(B) LED69.6(B) LED70.6(B) LED71.6(B) LED72.6(B)
N$199: IC9.20(SEGC) LED65.4(C) LED66.4(C) LED67.4(C) LED68.4(C) LED69.4(C) LED70.4(C) LED71.4(C) LED72.4(C)
N$200: IC9.23(SEGD) LED65.2(D) LED66.2(D) LED67.2(D) LED68.2(D) LED69.2(D) LED70.2(D) LED71.2(D) LED72.2(D)
N$201: IC9.21(SEGE) LED65.1(E) LED66.1(E) LED67.1(E) LED68.1(E) LED69.1(E) LED70.1(E) LED71.1(E) LED72.1(E)
N$202: IC9.17(SEGG) LED65.10(G) LED66.10(G) LED67.10(G) LED68.10(G) LED69.10(G) LED70.10(G) LED71.10(G) LED72.10(G)
N$203: IC9.15(SEGF) LED65.9(F) LED66.9(F) LED67.9(F) LED68.9(F) LED69.9(F) LED70.9(F) LED71.9(F) LED72.9(F)
N$205: IC9.24(DOUT) IC10.1(DIN)
N$206: IC12.22(SEGDP) LED89.5(DP) LED90.5(DP) LED91.5(DP) LED92.5(DP) LED93.5(DP) LED94.5(DP) LED95.5(DP) LED96.5(DP)
N$207: IC12.2(DIG0) LED89.3(COM) LED89.8(COM)
N$208: IC12.11(DIG1) LED90.3(COM) LED90.8(COM)
N$209: IC12.6(DIG2) LED91.3(COM) LED91.8(COM)
N$210: IC12.7(DIG3) LED92.3(COM) LED92.8(COM)
N$211: IC10.18(ISET) R11.2
N$212: IC10.22(SEGDP) LED73.5(DP) LED74.5(DP) LED75.5(DP) LED76.5(DP) LED77.5(DP) LED78.5(DP) LED79.5(DP) LED80.5(DP)
N$213: IC10.2(DIG0) LED73.3(COM) LED73.8(COM)
N$214: IC10.11(DIG1) LED74.3(COM) LED74.8(COM)
N$215: IC10.6(DIG2) LED75.3(COM) LED75.8(COM)
N$216: IC10.7(DIG3) LED76.3(COM) LED76.8(COM)
N$218: IC10.10(DIG5) LED78.3(COM) LED78.8(COM)
N$219: IC10.5(DIG6) LED79.3(COM) LED79.8(COM)
N$220: IC10.8(DIG7) LED80.3(COM) LED80.8(COM)
N$221: IC10.14(SEGA) LED73.7(A) LED74.7(A) LED75.7(A) LED76.7(A) LED77.7(A) LED78.7(A) LED79.7(A) LED80.7(A)
N$222: IC10.16(SEGB) LED73.6(B) LED74.6(B) LED75.6(B) LED76.6(B) LED77.6(B) LED78.6(B) LED79.6(B) LED80.6(B)
N$223: IC10.20(SEGC) LED73.4(C) LED74.4(C) LED75.4(C) LED76.4(C) LED77.4(C) LED78.4(C) LED79.4(C) LED80.4(C)
N$224: IC10.23(SEGD) LED73.2(D) LED74.2(D) LED75.2(D) LED76.2(D) LED77.2(D) LED78.2(D) LED79.2(D) LED80.2(D)
N$225: IC10.21(SEGE) LED73.1(E) LED74.1(E) LED75.1(E) LED76.1(E) LED77.1(E) LED78.1(E) LED79.1(E) LED80.1(E)
N$226: IC10.17(SEGG) LED73.10(G) LED74.10(G) LED75.10(G) LED76.10(G) LED77.10(G) LED78.10(G) LED79.10(G) LED80.10(G)
N$227: IC10.15(SEGF) LED73.9(F) LED74.9(F) LED75.9(F) LED76.9(F) LED77.9(F) LED78.9(F) LED79.9(F) LED80.9(F)
N$229: IC10.24(DOUT) IC11.1(DIN)
N$230: IC12.3(DIG4) LED93.3(COM) LED93.8(COM)
N$231: IC12.10(DIG5) LED94.3(COM) LED94.8(COM)
N$232: IC12.5(DIG6) LED95.3(COM) LED95.8(COM)
N$233: IC12.8(DIG7) LED96.3(COM) LED96.8(COM)
N$234: IC12.14(SEGA) LED89.7(A) LED90.7(A) LED91.7(A) LED92.7(A) LED93.7(A) LED94.7(A) LED95.7(A) LED96.7(A)
N$235: IC11.18(ISET) R12.2
N$236: IC11.22(SEGDP) LED81.5(DP) LED82.5(DP) LED83.5(DP) LED84.5(DP) LED85.5(DP) LED86.5(DP) LED87.5(DP) LED88.5(DP)
N$237: IC11.2(DIG0) LED81.3(COM) LED81.8(COM)
N$238: IC11.11(DIG1) LED82.3(COM) LED82.8(COM)
N$239: IC11.6(DIG2) LED83.3(COM) LED83.8(COM)
N$240: IC11.7(DIG3) LED84.3(COM) LED84.8(COM)
N$241: IC11.3(DIG4) LED85.3(COM) LED85.8(COM)
N$242: IC11.10(DIG5) LED86.3(COM) LED86.8(COM)
N$243: IC11.5(DIG6) LED87.3(COM) LED87.8(COM)
N$244: IC11.8(DIG7) LED88.3(COM) LED88.8(COM)
N$245: IC11.14(SEGA) LED81.7(A) LED82.7(A) LED83.7(A) LED84.7(A) LED85.7(A) LED86.7(A) LED87.7(A) LED88.7(A)
N$246: IC11.16(SEGB) LED81.6(B) LED82.6(B) LED83.6(B) LED84.6(B) LED85.6(B) LED86.6(B) LED87.6(B) LED88.6(B)
N$247: IC11.20(SEGC) LED81.4(C) LED82.4(C) LED83.4(C) LED84.4(C) LED85.4(C) LED86.4(C) LED87.4(C) LED88.4(C)
N$248: IC11.23(SEGD) LED81.2(D) LED82.2(D) LED83.2(D) LED84.2(D) LED85.2(D) LED86.2(D) LED87.2(D) LED88.2(D)
N$249: IC11.21(SEGE) LED81.1(E) LED82.1(E) LED83.1(E) LED84.1(E) LED85.1(E) LED86.1(E) LED87.1(E) LED88.1(E)
N$250: IC11.17(SEGG) LED81.10(G) LED82.10(G) LED83.10(G) LED84.10(G) LED85.10(G) LED86.10(G) LED87.10(G) LED88.10(G)
N$251: IC11.15(SEGF) LED81.9(F) LED82.9(F) LED83.9(F) LED84.9(F) LED85.9(F) LED86.9(F) LED87.9(F) LED88.9(F)
N$253: IC11.24(DOUT) IC12.1(DIN)
N$254: IC12.16(SEGB) LED89.6(B) LED90.6(B) LED91.6(B) LED92.6(B) LED93.6(B) LED94.6(B) LED95.6(B) LED96.6(B)
N$255: IC12.20(SEGC) LED89.4(C) LED90.4(C) LED91.4(C) LED92.4(C) LED93.4(C) LED94.4(C) LED95.4(C) LED96.4(C)
N$256: IC12.23(SEGD) LED89.2(D) LED90.2(D) LED91.2(D) LED92.2(D) LED93.2(D) LED94.2(D) LED95.2(D) LED96.2(D)
N$257: IC12.21(SEGE) LED89.1(E) LED90.1(E) LED91.1(E) LED92.1(E) LED93.1(E) LED94.1(E) LED95.1(E) LED96.1(E)
N$258: IC12.17(SEGG) LED89.10(G) LED90.10(G) LED91.10(G) LED92.10(G) LED93.10(G) LED94.10(G) LED95.10(G) LED96.10(G)
N$259: IC12.15(SEGF) LED89.9(F) LED90.9(F) LED91.9(F) LED92.9(F) LED93.9(F) LED94.9(F) LED95.9(F) LED96.9(F)
N$261: IC12.24(DOUT) SV2.4
VCC: C1.1 C2.1 C3.1 C4.1 C5.1 C6.1 C7.1 C8.1 C9.1 C10.1 C11.1 C12.1 C13.1 C14.1 C15.1 C16.1 C17.1 C18.1 C19.1 C20.1 C21.1 C22.1 C23.1 C24.1 IC1.19(VCC) IC2.19(VCC) IC3.19(VCC) IC4.19(VCC) IC5.19(VCC) IC6.19(VCC) IC7.19(VCC) IC8.19(VCC) IC9.19(VCC) IC10.19(VCC) IC11.19(VCC) IC12.19(VCC) R1.1 R3.1 R4.1 R5.1 R6.1 R7.1 R8.1 R9.1 R10.1 R11.1 R12.1 R13.1 SV1.5 SV2.5

## Library data of the parts
C1-C24 = capacitor-wima:C: CAPACITOR naming: grid - package width
IC1-IC12 = maxim:MAX7219CNG: LED DISPLAY DRIVER; MF: MAXIM; MPN: MAX7219CNG; OC_FARNELL: 1523914; OC_NEWARK: 34C4018
LED1-LED96 = display-kingbright:7-SEG_: Kingbright 14.2mm (0.56 INCH) SINGLE DIGIT NUMERIC DUISPLAY Source: SA56-11EWA(Ver1189471036.pdf; OC_FARNELL: unknown; OC_NEWARK: unknown
R1-R37 = rcl:R-US_: RESISTOR, American symbol; SPICEPREFIX: R
SV1 SV2 = con-lsta:FE05-1: FEMALE HEADER; OC_FARNELL: unknown; OC_NEWARK: unknown